# Altium schematic sheet LCD.SchDoc: LCD (part 2 of 2)
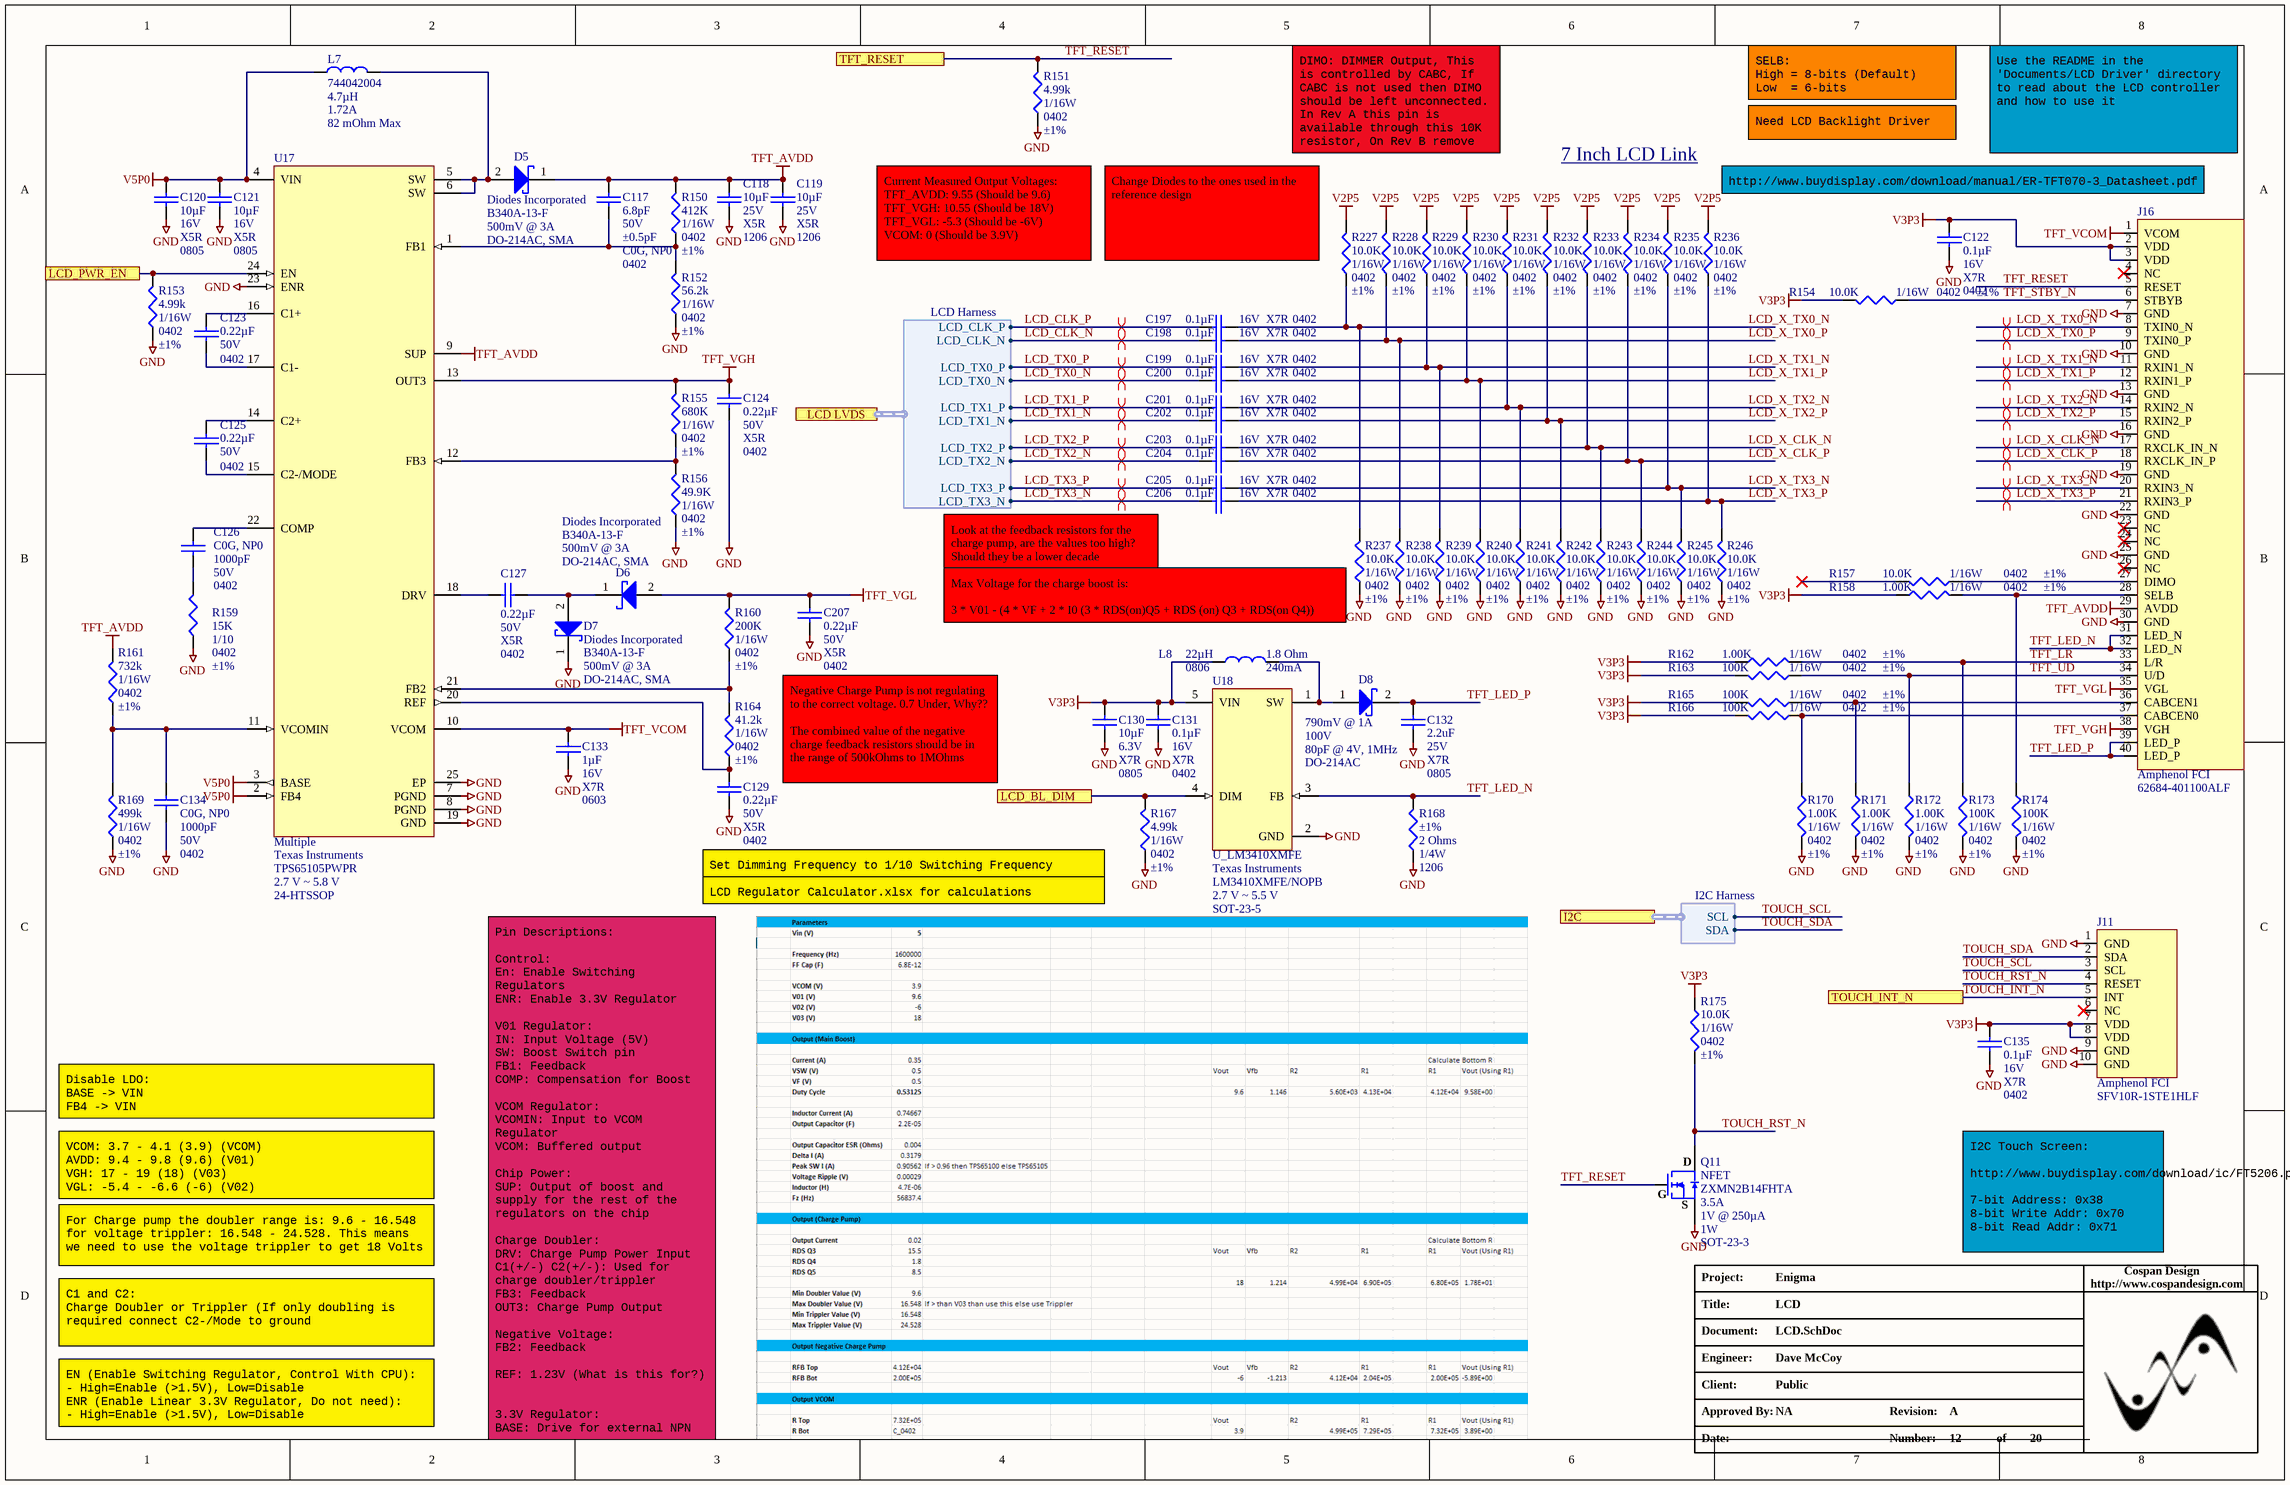
[diagram p1: LCD.SchDoc]

## Library data of the parts
C117 = C_0402_6.8PF_50V: CAP CER 6.8PF 50V NP0 0402; Manufacturer: Yageo; Manufacturer Part Number: CC0402DRNPO9BN6R8; Supplier 1: Digi-Key; Supplier Part Number 1: 311-1637-1-ND; RoHS: RoHS Compliant; Category: Capacitors; Stock 1: 80953; Mounting Type: Surface Mount, MLCC; Operating Temperature: -55°C ~ 125°C; Applications: General Purpose; Ratings: -; Size / Dimension: 0.039" L x 0.020" W (1.00mm x 0.50mm); Height - Seated (Max): -; Thickness (Max): 0.022" (0.55mm); Lead Spacing: -; Features: -; Packaging: Cut Tape (CT); Lead Style: -; ComponentLink1URL: http://www.yageo.com/documents/recent/UPY-GP_NP0_16V-to-50V_16.pdf; ComponentLink1Description: http://www.yageo.com/documents/recent/UPY-GP_NP0_16V-to-50V_16.pdf; Capacitance: 6.8pF; Pricing 1: 1=0.1, 10=0.022, 100=0.0097, 500=0.00692, 1000=0.00544, 2500=0.00494, 5000=0.00455 (USD); Part Status: Active; Failure Rate: -
C118 C119 = C_1206_10UF_25V: CAP CER 10UF 25V X5R 1206; Manufacturer: Murata Electronics North America; Manufacturer Part Number: GRM31CR61E106MA12L; Tolerance: ±20%; Supplier 1: Digi-Key; Supplier Part Number 1: 490-5423-1-ND; RoHS: RoHS Compliant; Category: Capacitors; Stock 1: 359069; Pricing: 1=0.51, 10=0.402, 50=0.2646, 100=0.2099, 250=0.15512, 500=0.12046, 1000=0.0949 (USD); Mounting Type: Surface Mount, MLCC; Operating Temperature: -55°C ~ 85°C; Applications: General Purpose; Ratings: -; Size / Dimension: 0.126" L x 0.063" W (3.20mm x 1.60mm); Height: -; Thickness: 0.071" (1.80mm); Lead Spacing: -; Features: -; Packaging: Cut Tape (CT); Lead Style: -; ComponentLink1URL: http://search.murata.co.jp/Ceramy/image/img/PDF/ENG/GRM31CR61E106MA12.pdf; ComponentLink1Description: http://search.murata.co.jp/Ceramy/image/img/PDF/ENG/GRM31CR61E106MA12.pdf; Capacitance: 10µF
C120 C121 = C_0805_10UF_16V: CAP CER 10uF 16V X5R 20% 0805; Manufacturer: Taiyo Yuden; Manufacturer Part Number: EMK212BJ106KG-T; Tolerance: ±10%; Supplier 1: Digi-Key; Supplier Part Number 1: 587-1295-1-ND; Category: Capacitors; Stock 1: 2052124; Capacitance: 10µF; RoHS: RoHS Compliant; Pricing 1: 1=0.2, 10=0.139, 100=0.0656, 500=0.04596, 1000=0.03805 (USD); Packaging: Cut Tape (CT); Part Status: Active; Operating Temperature: -55°C ~ 85°C; Features: -; Ratings: -; Applications: General Purpose; Mounting Type: Surface Mount, MLCC; Size / Dimension: 0.079" L x 0.049" W (2.00mm x 1.25mm); Height - Seated (Max): -; Thickness (Max): 0.053" (1.35mm); Lead Spacing: -; Lead Style: -; ComponentLink1URL: http://www.yuden.co.jp/productdata/catalog/en/mlcc01_e.pdf; ComponentLink1Description: http://www.yuden.co.jp/productdata/catalog/en/mlcc01_e.pdf
C122 C131 C135 C197-C206 = C_0402_0.1UF_16V: CAP CER .10UF 16V X7R 0402; Manufacturer: Murata Electronics North America; Manufacturer Part Number: GRM155R71C104KA88J; Tolerance: ±10%; Supplier 1: Digi-Key; Supplier Part Number 1: 490-6328-1-ND; RoHS: RoHS Compliant; Category: Capacitors; Stock 1: 18103134; Mounting Type: Surface Mount, MLCC; Features: -; Lead Spacing: -; Packaging: Cut Tape (CT); ComponentLink1URL: http://www.murata.com/~/media/webrenewal/support/library/catalog/products/capacitor/mlcc/c02e.ashx?la=en-us; ComponentLink1Description: http://www.murata.com/~/media/webrenewal/support/library/catalog/products/capacitor/mlcc/c02e.ashx?la=en-us; Operating Temperature: -55°C ~ 125°C; Pricing 1: 1=0.1, 10=0.014, 100=0.0062, 500=0.00442, 1000=0.00348, 2500=0.00316, 5000=0.00291 (USD); Part Status: Active; Ratings: -; Applications: General Purpose; Size / Dimension: 0.039" L x 0.020" W (1.00mm x 0.50mm); Height - Seated (Max): -; Thickness (Max): 0.022" (0.55mm)
C123-C125 C127 C129 C207 = C_0402_0.22UF_50V: CAP CER 0.22UF 50V X5R 0402; Manufacturer: Taiyo Yuden; Manufacturer Part Number: UMK105BJ224KV-F; Tolerance: ±10%; Supplier 1: Digi-Key; RoHS: RoHS Compliant; Category: Capacitors; Stock 1: 141424; Pricing 1: 1=0.35, 10=0.263, 50=0.1532, 100=0.1225, 250=0.08752, 500=0.0595, 1000=0.04813, 5000=0.03763 (USD); Packaging: Digi-Reel®; Mounting Type: Surface Mount, MLCC; Operating Temperature: -55°C ~ 85°C; Applications: General Purpose; Ratings: -; Size / Dimension: 0.039" L x 0.020" W (1.00mm x 0.50mm); Height - Seated (Max): -; Thickness (Max): 0.022" (0.55mm); Lead Spacing: -; Features: -; Lead Style: -; ComponentLink1URL: http://ds.yuden.co.jp/TYCOMPAS/ut/detail.do?productNo=UMK105BJ224KV-F&fileName=UMK105BJ224KV-F_SS&mode=specSheetDownload; ComponentLink1Description: http://ds.yuden.co.jp/TYCOMPAS/ut/detail.do?productNo=UMK105BJ224KV-F&fileName=UMK105BJ224KV-F_SS&mode=specSheetDownload; Supplier Part Number 1: 587-3500-6-ND
  C123 C125: Temperature Coefficient: X5R
C126 C134 = C_0402_1000PF_50V: CAP CER 1000PF 50V C0G 0402; Manufacturer: Murata Electronics North America; Manufacturer Part Number: GRM1555C1H102JA01D; Tolerance: ±5%; Supplier 1: Digi-Key; RoHS: RoHS Compliant; Category: Capacitors; Stock 1: 1327660; Pricing 1: 10=0.073, 100=0.0429, 500=0.02476, 1000=0.01716 (USD); Mounting Type: Surface Mount, MLCC; Operating Temperature: -55°C ~ 125°C; Features: -; Applications: General Purpose; Ratings: -; Size / Dimension: 0.040" L x 0.020" W (1.00mm x 0.50mm); Lead Spacing: -; Thickness: 0.50mm; Packaging: Cut Tape (CT); Lead Style: -; ComponentLink1URL: http://search.murata.co.jp/Ceramy/image/img/PDF/ENG/GRM1555C1H102JA01.pdf; ComponentLink1Description: http://search.murata.co.jp/Ceramy/image/img/PDF/ENG/GRM1555C1H102JA01.pdf; Supplier Part Number 1: 490-3244-1-ND; Capacitance: 1000pF
C130 = C_0805_10UF_6.3V: CAP CER 10UF 6.3V X7R 10% 0805; Manufacturer: Taiyo Yuden; Manufacturer Part Number: JMK212BJ106KD-T; Supplier 1: Digi-Key; Supplier Part Number 1: 587-1304-1-ND; RoHS: RoHS Compliant; Category: Capacitors; Stock 1: 94004; Tolerance: ±10%; Mounting Type: Surface Mount, MLCC; Operating Temperature: -55°C ~ 85°C; Applications: General Purpose; Ratings: -; Size / Dimension: 0.079" L x 0.049" W (2.00mm x 1.25mm); Lead Spacing: -; Features: -; Packaging: Cut Tape (CT); Lead Style: -; ComponentLink1URL: http://www.yuden.co.jp/productdata/catalog/en/mlcc01_e.pdf; ComponentLink1Description: http://www.yuden.co.jp/productdata/catalog/en/mlcc01_e.pdf; Pricing 1: 1=0.19, 10=0.132, 50=0.08, 100=0.0672, 250=0.0544, 500=0.048, 1000=0.0408 (USD); Height - Seated (Max): -; Thickness (Max): 0.037" (0.95mm)
C132 = C_0805_2.2uF_25V: Manufacturer: Taiyo Yuden; Manufacturer Part Number: TMK212B7225KG-TR; Tolerance: ±10%; Supplier 1: Digi-Key; RoHS: RoHS Compliant; Category: Capacitors; Stock 1: 119541; Pricing 1: 1=0.34, 10=0.255, 50=0.1488, 100=0.119, 250=0.085, 500=0.0578, 1000=0.04675 (USD); Packaging: Cut Tape (CT); Part Status: Active; Operating Temperature: -55°C ~ 125°C; Features: -; Ratings: -; Applications: General Purpose; Failure Rate: *; Mounting Type: Surface Mount, MLCC; Size / Dimension: 0.079" L x 0.049" W (2.00mm x 1.25mm); Height - Seated (Max): -; Thickness (Max): 0.053" (1.35mm); Lead Spacing: -; Lead Style: -; ComponentLink1URL: http://ds.yuden.co.jp/TYCOMPAS/ut/detail.do?productNo=TMK212B7225KG-TR&fileName=TMK212B7225KG-TR_SS&mode=specSheetDownload; ComponentLink1Description: http://ds.yuden.co.jp/TYCOMPAS/ut/detail.do?productNo=TMK212B7225KG-TR&fileName=TMK212B7225KG-TR_SS&mode=specSheetDownload; Supplier Part Number 1: 587-2991-1-ND
C133 = C_0603_1µF_16V: CAP CER 1UF 16V X7R 0603; Manufacturer: Yageo; Manufacturer Part Number: CC0603KRX7R7BB105; Tolerance: 10%; Dissipation Factor: 5%; Supplier 1: Digikey; Stock 1: 531531; Pricing 1: 1=0.1, 10=0.053, 100=0.0237, 500=0.0169, 1000=0.0133 (USD); Mount: Surface Mount; Case/Package: 0603; Number of Pins: 2; Case Code (Metric): 1608; Case Code (Imperial): 0603; Min Operating Temperature: -55°C; Max Operating Temperature: 125°C; Voltage Rating: 16V; Package Quantity: 1; Packaging: Tape and Reel; Voltage Rating (DC): 16V; Dielectric: X7R; Termination: SMD/SMT; Composition: Ceramic; Length: 1.6mm; Height: 0.8mm; Width: 0.031inch; Thickness: 0.035inch; Depth: 0.8mm; Radiation Hardening: No; REACH SVHC: Unknown; Lead Free: Lead Free; Halogen Free: Halogen Free; ComponentLink1URL: https://datasheet.ciiva.com/176/mlccorderingcode-176788.pdf; ComponentLink1Description: https://datasheet.ciiva.com/176/mlccorderingcode-176788.pdf; ComponentLink2URL: https://datasheet.ciiva.com/176/mlccorderingcode-176789.pdf; ComponentLink2Description: https://datasheet.ciiva.com/176/mlccorderingcode-176789.pdf; ComponentLink3URL: https://datasheet.ciiva.com/176/mlccorderingcode-176790.pdf; ComponentLink3Description: https://datasheet.ciiva.com/176/mlccorderingcode-176790.pdf; ComponentLink4URL: https://datasheet.ciiva.com/5425/upy-gphc-x7r-6-3v-to-50v-8-12304-5425495.pdf; ComponentLink4Description: https://datasheet.ciiva.com/5425/upy-gphc-x7r-6-3v-to-50v-8-12304-5425495.pdf; ComponentLink5URL: https://datasheet.ciiva.com/16625/upy-gphc-x7r-6-3v-to-50v-8-16625527.pdf; ComponentLink5Description: https://datasheet.ciiva.com/16625/upy-gphc-x7r-6-3v-to-50v-8-16625527.pdf; ComponentLink6URL: https://datasheet.ciiva.com/8033/1734573-8033800.pdf; ComponentLink6Description: https://datasheet.ciiva.com/8033/1734573-8033800.pdf; ComponentLink7URL: https://datasheet.ciiva.com/8033/1734573-8033801.pdf; ComponentLink7Description: https://datasheet.ciiva.com/8033/1734573-8033801.pdf; ComponentLink8URL: https://datasheet.ciiva.com/28450/1489800-28450557.pdf; ComponentLink8Description: https://datasheet.ciiva.com/28450/1489800-28450557.pdf; ComponentLink9URL: https://datasheet.ciiva.com/7978/1489800-7978143.pdf; ComponentLink9Description: https://datasheet.ciiva.com/7978/1489800-7978143.pdf; Supplier Part Number 1: 311-1446-6-ND
D5-D7 = D_B340A-13-F: DIODE SCHOTTKY 40V 3A SMA; Speed: Fast Recovery =< 500ns, > 200mA (Io); Current - Reverse Leakage @ Vr: 500µA @ 40V; Capacitance @ Vr, F: 200pF @ 4V, 1MHz; Supplier 1: Digi-Key; RoHS: RoHS Compliant; Category: Discrete Semiconductor Products; Stock 1: 808310; Pricing 1: 1=0.46, 10=0.373, 100=0.2538, 500=0.19034, 1000=0.14276 (USD); Packaging: Cut Tape (CT); Diode Type: Schottky; Current - Average Rectified (Io): 3A; Mounting Type: Surface Mount; Supplier Device Package: SMA; Operating Temperature - Junction: -55°C ~ 150°C; ComponentLink1URL: https://www.diodes.com/assets/Datasheets/ds30891.pdf; ComponentLink1Description: https://www.diodes.com/assets/Datasheets/ds30891.pdf; Supplier Part Number 1: B340A-FDICT-ND; Part Status: Active
D8 = D_SCHOTT_B1100-13-F: DIODE SCHOTTKY 100V 1A SMA; Manufacturer: Diodes Inc; Speed: Fast Recovery =< 500ns, > 200mA (Io); Current - Reverse Leakage @ Vr: 500µA @ 100V; Supplier 1: Digi-Key; Supplier Part Number 1: B1100-FDICT-ND; Manufacturer Part Number: B1100-13-F; RoHS: RoHS Compliant; Category: Discrete Semiconductor Products; Stock 1: 109264; Pricing: 1=0.57, 10=0.4, 25=0.3288, 100=0.2627, 250=0.1914, 500=0.15544, 1000=0.11948, 2500=0.1073 (USD); Diode Type: Schottky; Current - Average Rectified (Io): 1A; Reverse Recovery Time (trr): -; Mounting Type: Surface Mount; Supplier Device Package: SMA; Packaging: Cut Tape (CT); ComponentLink1URL: http://www.diodes.com/datasheets/ds30018.pdf; ComponentLink1Description: http://www.diodes.com/datasheets/ds30018.pdf; COST_1: *; COST_100: *; COST_1000: *; MANF1: *; MANF1_PN: *; MANF2: *; MANF2_PN: *; MANF3: *; MANF3_PN: *; VENDOR1: *; VENDOR1_PN: *
J11 = J_FFC_CONN_RA_10PIN: CONN FFC BOTTOM 10POS 0.50MM R/A; Flat Flex Type: FFC, FPC; Connector/Contact Type: Contacts, Bottom; Number of Positions: 10; Pitch: 0.020" (0.50mm); FFC, FCB Thickness: 0.30mm, 0.33mm; Locking Feature: Slide Lock; Cable End Type: Straight, Tapered; Actuator Material: Polyphenylene Sulfide (PPS), Glass Filled, Halogen Free; Voltage Rating: 50V; Material Flammability Rating: UL94 V-0; Current Rating: 0.5A; Actuator Color: Black; Mating Cycles: 20; Supplier 1: Digi-Key; RoHS: RoHS Compliant; Category: Connectors, Interconnects; Stock 1: 9118; Pricing 1: 1=0.76, 10=0.667, 25=0.6276, 50=0.6014, 100=0.5752, 250=0.52296, 500=0.47064, 1000=0.41835 (USD); Packaging: Cut Tape (CT); Part Status: Active; Mounting Type: Surface Mount, Right Angle; Termination: Solder; Height Above Board: 0.071" (1.80mm); Contact Material: Phosphor Bronze; Contact Finish: Tin; Housing Material: Polyamide (PA), Nylon, Glass Filled, Halogen Free; Features: Solder Retention, Zero Insertion Force (ZIF); Operating Temperature: -55°C ~ 105°C; Contact Finish Thickness: -; Housing Color: Black; ComponentLink1URL: http://portal.fciconnect.com/Comergent//fci/drawing/10112793.pdf; ComponentLink1Description: http://portal.fciconnect.com/Comergent//fci/drawing/10112793.pdf; Supplier Part Number 1: 609-4305-1-ND
J16 = J_FFC_CONN_RA_40PIN: CONN FPC BOTTOM 40POS 0.50MM R/A; Actuator Material: Glass,Thermoplastic; Gender: Receptacle; Current Rating: 500mA; Voltage Rating: 50V; Contact Resistance: 30mR; Number of Positions: 40; Insulation Resistance: 100MR; Pitch: 0.5mm; Supplier 1: Avnet; Stock 1: 1397; Pricing 1: 1=0.735, 40=0.6936, 100=0.6627, 200=0.6125, 500=0.5422 (USD); Mount: Surface Mount; Case/Package: SMD/SMT; Contact Material: Bronze; Contact Plating: Gold; Housing Colour: Beige; Housing Material: Thermoplastic; Min Operating Temperature: -55°C; Max Operating Temperature: 85°C; Number of Rows: 1; Packaging: Tape and Reel; Package Quantity: 2000; Termination: Solder; Contact Location: Bottom; Number of Contacts: 40; Max Voltage Rating (AC): 50V; Max Voltage Rating (DC): 50V; Orientation: Right Angle; Length: 25.5mm; Depth: 5mm; Width: 5mm; REACH SVHC: No SVHC; Lead Free: Lead Free; Flammability Rating: UL94 V-0; ComponentLink1URL: https://datasheet.ciiva.com/25631/0900766b8118e51f-25631168.pdf; ComponentLink1Description: https://datasheet.ciiva.com/25631/0900766b8118e51f-25631168.pdf; ComponentLink2URL: https://datasheet.ciiva.com/3112/62684-3112007.pdf; ComponentLink2Description: https://datasheet.ciiva.com/3112/62684-3112007.pdf; ComponentLink3URL: https://datasheet.ciiva.com/670/62684-670200.pdf; ComponentLink3Description: https://datasheet.ciiva.com/670/62684-670200.pdf; ComponentLink4URL: https://datasheet.ciiva.com/670/62684-670201.pdf; ComponentLink4Description: https://datasheet.ciiva.com/670/62684-670201.pdf; ComponentLink5URL: https://datasheet.ciiva.com/670/62684-670202.pdf; ComponentLink5Description: https://datasheet.ciiva.com/670/62684-670202.pdf; ComponentLink6URL: https://datasheet.ciiva.com/16659/62684-16659882.pdf; ComponentLink6Description: https://datasheet.ciiva.com/16659/62684-16659882.pdf; ComponentLink7URL: https://datasheet.ciiva.com/16709/70236840-16709916.pdf; ComponentLink7Description: https://datasheet.ciiva.com/16709/70236840-16709916.pdf; ComponentLink8URL: https://datasheet.ciiva.com/3112/62684-3112397.pdf; ComponentLink8Description: https://datasheet.ciiva.com/3112/62684-3112397.pdf; ComponentLink9URL: https://datasheet.ciiva.com/5772/62684-5772782.pdf; ComponentLink9Description: https://datasheet.ciiva.com/5772/62684-5772782.pdf; Supplier Part Number 1: 62684-401100ALF/BKN
L7 = L_4.70UH_1.72A_SMD: INDUCTOR POWER 4.7UH 1.72A SMD; Manufacturer: Wurth Electronics Inc; Current - Saturation: 1.65A; Tolerance: ±30%; Shielding: Shielded; Frequency - Self Resonant: 70MHz; Frequency - Test: 100kHz; Supplier 1: Digi-Key; Supplier Part Number 1: 732-1021-1-ND; RoHS: RoHS Compliant; Category: Inductors, Coils, Chokes; Stock 1: 9223; Pricing: 1=1.85, 25=1.5444, 100=1.3128, 250=1.15836 (USD); Current - Temperature Rise: -; Type: -; Q @ Freq: -; Package / Case: 0.189" L x 0.189" W x 0.071" H (4.80mm x 4.80mm x 1.80mm); Packaging: Cut Tape (CT); Operating Temperature: -40°C ~ 125°C; Material - Core: -; Applications: General Purpose; ComponentLink1URL: http://katalog.we-online.de/kataloge/eisos/media/pdf/744042004.pdf; ComponentLink1Description: http://katalog.we-online.de/kataloge/eisos/media/pdf/744042004.pdf; Mounting Type: Surface Mount
L8 = L_0806_22uH: INDUCTOR 22UH 10% 0806 SMD; Manufacturer: Taiyo Yuden; Type: Wirewound; Current - Saturation: 250mA; Shielding: Unshielded; Frequency - Self Resonant: 16MHz; Frequency - Test: 2.52MHz; Supplier 1: Digi-Key; Supplier Part Number 1: 587-3048-1-ND; Manufacturer Part Number: CBC2016T220K; RoHS: RoHS Compliant; Category: Inductors, Coils, Chokes; Stock 1: 3275; Pricing: 1=0.2, 10=0.192, 50=0.18, 100=0.168, 500=0.132, 1000=0.108 (USD); Packaging: Cut Tape (CT); Material - Core: -; Tolerance: ±10%; Current Rating: 240mA; Q @ Freq: -; Operating Temperature: -40°C ~ 105°C; Mounting Type: Surface Mount; Size / Dimension: 0.079" L x 0.063"W (2.00mm x 1.60mm); Height - Seated (Max): 0.071" (1.80mm); Supplier Device Package: 0806 (2016 Metric); ComponentLink1URL: http://www.yuden.co.jp/ut/product/category/inductor/CBC2016T220K.pdf; ComponentLink1Description: http://www.yuden.co.jp/ut/product/category/inductor/CBC2016T220K.pdf
Q11 = Q_NFET_3.50A_SOT23: MOSFET N-CH 20V 3.5A SOT23-3; Manufacturer: Diodes Incorporated; FET Type: N-Channel; Current - Continuous Drain (Id) @ 25°C: 3.5A (Ta); Drive Voltage (Max Rds On,  Min Rds On): 1.8V, 4.5V; Gate Charge (Qg) (Max) @ Vgs: 11nC @ 4.5V; Input Capacitance (Ciss) (Max) @ Vds: 872pF @ 10V; Vgs (Max): ±8V; Power Dissipation (Max): 1W (Ta); Rds On (Max) @ Id, Vgs: 55 mOhm @ 3.5A, 4.5V; Supplier 1: Digi-Key; RoHS: RoHS Compliant; Category: Discrete Semiconductor Products; Stock 1: 1379; Pricing 1: 1=0.78, 10=0.683, 100=0.5238, 500=0.41406, 1000=0.33125 (USD); Packaging: Cut Tape (CT); Part Status: Active; Technology: MOSFET (Metal Oxide); Drain to Source Voltage (Vdss): 20V; FET Feature: -; Operating Temperature: -55°C ~ 150°C (TJ); Mounting Type: Surface Mount; Supplier Device Package: SOT-23-3; ComponentLink1URL: http://www.diodes.com/_files/datasheets/ZXMN2B14FH.pdf; ComponentLink1Description: http://www.diodes.com/_files/datasheets/ZXMN2B14FH.pdf; Supplier Part Number 1: ZXMN2B14FHCT-ND
R150 = R_0402_412K: Manufacturer 1: Yageo; Manufacturer Part Number 1: RC0402FR-07412KL; Description 1: Thick Film Resistors 412K OHM 1%; Voltage Rating: 50V; Resistance: 412kR; Power Rating: 62.5mW; Temperature Coefficient: 100ppm/°C; Max Power Dissipation: 63mW; Supplier 1: Mouser; Supplier Part Number 1: 603-RC0402FR-07412KL; Stock 1: 8330; Pricing 1: 1=0.1, 10=0.008, 50=0.008, 100=0.002, 1000=0.002, 10000=0.002 (USD); Case/Package: 0402; Weight: 2.3E-05oz; Case Code (Imperial): 0402; Case Code (Metric): 1005; Contact Plating: Tin,Matte; Min Operating Temperature: -55°C; Max Operating Temperature: 155°C; Packaging: Tape and Reel; Composition: Thick Film; Termination: SMD/SMT; Number of Terminations: 2; Military Standard: Not; Voltage Rating (DC): 50V; Length: 1mm; Height: 0.016inch; Width: 0.5mm; Depth: 0.5mm; Lead Free: Lead Free; ComponentLink1URL: https://datasheet.ciiva.com/28390/pyu-rc0402-51-rohs-l-6-28390954.pdf; ComponentLink1Description: https://datasheet.ciiva.com/28390/pyu-rc0402-51-rohs-l-6-28390954.pdf; ComponentLink2URL: https://datasheet.ciiva.com/16857/pyu-rc0402-51-rohs-l-6-16857086.pdf; ComponentLink2Description: https://datasheet.ciiva.com/16857/pyu-rc0402-51-rohs-l-6-16857086.pdf
R151 R153 R167 = R_0402_4.99k: RES TF 4.99K OHM 1% 1/16W 0402; Manufacturer: Stackpole Electronics Inc; Manufacturer Part Number: RMCF0402FT4K99; Temperature Coefficient: ±100ppm/°C; Supplier 1: Digi-Key; RoHS: RoHS Compliant; Category: Resistors; Stock 1: 81236; Pricing 1: 1=0.04, 10=0.025, 50=0.0138, 100=0.0105, 250=0.0078, 500=0.00576, 1000=0.00384, 2500=0.00324, 5000=0.0027 (USD); Resistance (Ohms): 4.99k; Composition: Thick Film; Features: -; Package / Case: 0402 (1005 Metric); Size / Dimension: 0.039" L x 0.020" W (1.00mm x 0.50mm); Height: 0.016" (0.40mm); Number of Terminations: 2; Packaging: Cut Tape (CT); ComponentLink1URL: http://www.seielect.com/Catalog/SEI-RMCF_RMCP.pdf; ComponentLink1Description: http://www.seielect.com/Catalog/SEI-RMCF_RMCP.pdf; Supplier Part Number 1: RMCF0402FT4K99CT-ND; Resistance In Ohms: 4.99k
R152 = R_0402_56.2k: RES 56.2K OHM 1/16W 1% 0402 SMD; Manufacturer: Vishay Dale; Manufacturer Part Number: CRCW040256K2FKED; Temperature Coefficient: ±100ppm/°C; Supplier 1: Digi-Key; Supplier Part Number 1: 541-56.2KLCT-ND; RoHS: RoHS Compliant; Category: Resistors; Stock 1: 2237; Pricing: 10=0.083, 50=0.0444, 200=0.0255, 1000=0.0174 (USD); Resistance (Ohms): 56.2k; Composition: Thick Film; Features: -; Package / Case: 0402 (1005 Metric); Size / Dimension: 0.039" L x 0.020" W (1.00mm x 0.50mm); Height: 0.016" (0.40mm); Number of Terminations: 2; Packaging: Cut Tape (CT); ComponentLink1URL: http://www.vishay.com/doc?20035; ComponentLink1Description: http://www.vishay.com/doc?20035; Resistance In Ohms: 56.2k
R154 R157 R175 R227-R246 = R_0402_10.0K: RES 10.0K OHM 1/16W 1% 0402 SMD; Manufacturer: Stackpole Electronics Inc; Manufacturer Part Number: RMCF0402FT10K0; Resistance (Ohms): 10k; Temperature Coefficient: ±100ppm/°C; Supplier 1: Digi-Key; Supplier Part Number 1: RMCF0402FT10K0CT-ND; RoHS: RoHS Compliant; Category: Resistors; Stock 1: 234525; Pricing: 1=0.04, 10=0.025, 50=0.0138, 100=0.0105, 250=0.0078, 500=0.00576, 1000=0.00384, 2500=0.00324, 5000=0.0027 (USD); Composition: Thick Film; Features: -; Package / Case: 0402 (1005 Metric); Size / Dimension: 0.039" L x 0.020" W (1.00mm x 0.50mm); Height: 0.016" (0.40mm); Number of Terminations: 2; Packaging: Cut Tape (CT); ComponentLink1URL: http://www.seielect.com/Catalog/SEI-RMCF_RMCP.pdf; ComponentLink1Description: http://www.seielect.com/Catalog/SEI-RMCF_RMCP.pdf
R155 = R_0402_680K: Res Thick Film 0402 68K Ohm 1% 0.1W(1/10W) Â±100ppm/Â°C Molded SMD Automotive Punched T/R; Manufacturer: Yageo; Manufacturer Part Number: RC0402FR-07680KL; Temperature Coefficient: ±100ppm/°C; Supplier 1: Digi-Key; Stock 1: 179358; Pricing 1: 1=0.1, 10=0.014, 100=0.0055, 1000=0.00247, 2500=0.00214, 5000=0.00177 (USD); ComponentLink1URL: http://www.yageo.com/documents/recent/PYu-RC_Group_51_RoHS_L_7.pdf; ComponentLink1Description: http://www.yageo.com/documents/recent/PYu-RC_Group_51_RoHS_L_7.pdf; Supplier Part Number 1: YAG3211CT-ND; RoHS: RoHS Compliant; Category: Resistors; Packaging: Cut Tape (CT); Part Status: Active; Composition: Thick Film; Features: Moisture Resistant; Operating Temperature: -55°C ~ 155°C; Package / Case: 0402 (1005 Metric); Supplier Device Package: 0402; Size / Dimension: 0.039" L x 0.020" W (1.00mm x 0.50mm); Height - Seated (Max): 0.016" (0.40mm); Failure Rate: -
R156 = R_0402_49.9K: RES 49.9K OHM 1/16W 1% 0402 SMD; Manufacturer: Vishay Dale; Manufacturer Part Number: CRCW040249K9FKED; Temperature Coefficient: ±100ppm/°C; Supplier 1: Digi-Key; Supplier Part Number 1: 541-49.9KLCT-ND; RoHS: RoHS Compliant; Category: Resistors; Stock 1: 96786; Pricing: 10=0.083, 50=0.0444, 200=0.0255, 1000=0.0174 (USD); Resistance (Ohms): 49.9K; Composition: Thick Film; Features: -; Package / Case: 0402 (1005 Metric); Size / Dimension: 0.039" L x 0.020" W (1.00mm x 0.50mm); Height: 0.016" (0.40mm); Number of Terminations: 2; Packaging: Cut Tape (CT); ComponentLink1URL: http://www.vishay.com/doc?20035; ComponentLink1Description: http://www.vishay.com/doc?20035; Supplier 2: Digi-Key; Stock 2: 838340; Pricing 2: 1=0.1, 10=0.014, 100=0.0056, 1000=0.00253, 2500=0.0022, 5000=0.00181 (USD); Part Status: Active; Operating Temperature: -55°C ~ 155°C; Supplier Device Package: 0402; Height - Seated (Max): 0.016" (0.40mm); Failure Rate: -; ComponentLink2URL: http://www.yageo.com/documents/recent/PYu-RC_Group_51_RoHS_L_7.pdf; ComponentLink2Description: http://www.yageo.com/documents/recent/PYu-RC_Group_51_RoHS_L_7.pdf; Supplier Part Number 2: 311-49.9KLRCT-ND
R158 R162 R170-R172 = R_0402_1.0K: RES 1.00K OHM 1/16W 1% 0402 SMD; Manufacturer: Yageo; Manufacturer Part Number: RC0402FR-071KL; Resistance (Ohms): 1K; Temperature Coefficient: ±100ppm/°C; Supplier 1: Digi-Key; Supplier Part Number 1: 311-1.00KLRCT-ND; RoHS: RoHS Compliant; Category: Resistors; Stock 1: 2103351; Pricing: 10=0.014, 100=0.0063, 500=0.00382, 1000=0.0027, 5000=0.00203 (USD); Composition: Thick Film; Features: -; Package / Case: 0402 (1005 Metric); Size / Dimension: 0.039" L x 0.020" W (1.00mm x 0.50mm); Height: 0.016" (0.40mm); Number of Terminations: 2; Packaging: Cut Tape (CT); ComponentLink1URL: http://www.yageo.com/documents/recent/PYu-RC0402_51_RoHS_L_6.pdf; ComponentLink1Description: http://www.yageo.com/documents/recent/PYu-RC0402_51_RoHS_L_6.pdf
R159 = R_0402_15.0K: RES 15.0K OHM 1/10W 1% 0402 SMD; Manufacturer: Panasonic - ECG; Manufacturer Part Number: ERJ-2RKF1502X; Temperature Coefficient: ±100ppm/°C; Supplier 1: Digi-Key; Supplier Part Number 1: P15.0KLCT-ND; RoHS: RoHS Compliant; Category: Resistors; Stock 1: 695227; Pricing: 1=0.06, 50=0.0242, 100=0.0184, 250=0.01364, 500=0.01008, 1000=0.00672, 5000=0.00473 (USD); Resistance (Ohms): 15K; Composition: Thick Film; Features: -; Size / Dimension: 0.039" L x 0.020" W (1.00mm x 0.50mm); Height: 0.016" (0.40mm); Number of Terminations: 2; Packaging: Cut Tape (CT); Package / Case: 0402 (1005 Metric); ComponentLink1URL: http://industrial.panasonic.com/www-cgi/jvcr13pz.cgi?E+PZ+3+AOA0002+ERJ2RKF1502X+7+WW; ComponentLink1Description: http://industrial.panasonic.com/www-cgi/jvcr13pz.cgi?E+PZ+3+AOA0002+ERJ2RKF1502X+7+WW
R160 = R_0402_200.0K: RES 200K OHM 1/16W 1% 0402 SMD; Manufacturer: Yageo; Manufacturer Part Number: RC0402FR-07200KL; Temperature Coefficient: ±100ppm/°C; Supplier 1: Digi-Key; Supplier Part Number 1: 311-200KLRCT-ND; RoHS: RoHS Compliant; Category: Resistors; Stock 1: 533277; Pricing: 10=0.014, 50=0.0104, 100=0.0079, 250=0.00584, 500=0.00432, 1000=0.00288 (USD); Resistance (Ohms): 200K; Composition: Thick Film; Features: -; Size / Dimension: 0.039" L x 0.020" W (1.00mm x 0.50mm); Height: 0.016" (0.40mm); Number of Terminations: 2; Packaging: Cut Tape (CT); Package / Case: 0402 (1005 Metric); ComponentLink1URL: http://www.yageo.com/documents/recent/PYu-RC0402_51_RoHS_L_6.pdf; ComponentLink1Description: http://www.yageo.com/documents/recent/PYu-RC0402_51_RoHS_L_6.pdf
R161 = R_0402_732k: RES SMD 732K OHM 1% 1/16W 0402; Manufacturer: Yageo; Manufacturer Part Number: RC0402FR-07732KL; Temperature Coefficient: ±100ppm/°C; Supplier 1: Digi-Key; RoHS: RoHS Compliant; Category: Resistors; Stock 1: 86604; Pricing 1: 1=0.1, 10=0.014, 100=0.0055, 1000=0.00247, 2500=0.00214, 5000=0.00177 (USD); Packaging: Cut Tape (CT); Part Status: Active; Composition: Thick Film; Features: Moisture Resistant; Operating Temperature: -55°C ~ 155°C; Package / Case: 0402 (1005 Metric); Supplier Device Package: 0402; Size / Dimension: 0.039" L x 0.020" W (1.00mm x 0.50mm); Height - Seated (Max): 0.016" (0.40mm); Failure Rate: -; ComponentLink1URL: http://www.yageo.com/documents/recent/PYu-RC_Group_51_RoHS_L_7.pdf; ComponentLink1Description: http://www.yageo.com/documents/recent/PYu-RC_Group_51_RoHS_L_7.pdf; Supplier Part Number 1: YAG3224CT-ND
R163 R165 R166 R173 R174 = R_0402_100K: RES SMD 100K OHM 1% 1/16W 0402; Manufacturer: Yageo; Manufacturer Part Number: RC0402FR-07100KL; Temperature Coefficient: ±100ppm/°C; Supplier 1: Digi-Key; RoHS: RoHS Compliant; Category: Resistors; Stock 1: 4989982; Pricing 1: 1=0.1, 10=0.013, 25=0.0096, 100=0.0054, 250=0.00412, 500=0.00328, 1000=0.00242, 2500=0.0021, 5000=0.00173 (USD); Packaging: Cut Tape (CT); Resistance (Ohms): 100k; Composition: Thick Film; Features: Moisture Resistant; Operating Temperature: -55°C ~ 155°C; Package / Case: 0402 (1005 Metric); Supplier Device Package: 0402; Size / Dimension: 0.039" L x 0.020" W (1.00mm x 0.50mm); Height: 0.016" (0.40mm); Number of Terminations: 2; ComponentLink1URL: http://www.yageo.com/NewPortal/yageodocoutput?fileName=/pdf/R-Chip/PYu-RC_Group_51_RoHS_L_3.pdf; ComponentLink1Description: http://www.yageo.com/NewPortal/yageodocoutput?fileName=/pdf/R-Chip/PYu-RC_Group_51_RoHS_L_3.pdf; Supplier Part Number 1: 311-100KLRCT-ND
R164 = R_0402_41.2K: RES SMD 41.2K OHM 1% 1/16W 0402; Manufacturer: Yageo; Manufacturer Part Number: RC0402FR-0741K2L; Temperature Coefficient: ±100ppm/°C; Supplier 1: Digi-Key; RoHS: RoHS Compliant; Category: Resistors; Stock 1: 299912; Pricing 1: 1=0.1, 10=0.014, 100=0.0055, 1000=0.00247, 2500=0.00214, 5000=0.00177 (USD); Packaging: Cut Tape (CT); Part Status: Active; Composition: Thick Film; Features: Moisture Resistant; Operating Temperature: -55°C ~ 155°C; Package / Case: 0402 (1005 Metric); Supplier Device Package: 0402; Size / Dimension: 0.039" L x 0.020" W (1.00mm x 0.50mm); Height - Seated (Max): 0.016" (0.40mm); Failure Rate: -; ComponentLink1URL: http://www.yageo.com/documents/recent/PYu-RC_Group_51_RoHS_L_7.pdf; ComponentLink1Description: http://www.yageo.com/documents/recent/PYu-RC_Group_51_RoHS_L_7.pdf; Supplier Part Number 1: YAG3155CT-ND
R168 = R_1206_2: RES SMD 2 OHM 1% 1/4W 1206; Manufacturer: Yageo; Manufacturer Part Number: RC1206FR-072RL; Temperature Coefficient: ±200ppm/°C; Supplier 1: Digi-Key; RoHS: RoHS Compliant; Category: Resistors; Stock 1: 1070212; Pricing 1: 1=0.1, 10=0.053, 100=0.0216, 1000=0.00972, 2500=0.00844 (USD); Packaging: Cut Tape (CT); Part Status: Active; Composition: Thick Film; Features: Moisture Resistant; Operating Temperature: -55°C ~ 155°C; Package / Case: 1206 (3216 Metric); Supplier Device Package: 1206; Size / Dimension: 0.122" L x 0.063" W (3.10mm x 1.60mm); Height - Seated (Max): 0.026" (0.65mm); Failure Rate: -; ComponentLink1URL: http://www.yageo.com/documents/recent/PYu-RC_Group_51_RoHS_L_7.pdf; ComponentLink1Description: http://www.yageo.com/documents/recent/PYu-RC_Group_51_RoHS_L_7.pdf; Supplier Part Number 1: 311-2.00FRCT-ND
R169 = R_0402_499k: RES SMD 499K OHM 1% 1/16W 0402; Manufacturer: Yageo; Manufacturer Part Number: RC0402FR-07499KL; Temperature Coefficient: ±100ppm/°C; Supplier 1: Digi-Key; RoHS: RoHS Compliant; Category: Resistors; Stock 1: 691166; Pricing 1: 1=0.1, 10=0.013, 25=0.0096, 100=0.0054, 250=0.00412, 500=0.00328, 1000=0.00242, 2500=0.0021, 5000=0.00173 (USD); Packaging: Cut Tape (CT); Resistance (Ohms): 499k; Composition: Thick Film; Features: Moisture Resistant; Operating Temperature: -55°C ~ 155°C; Package / Case: 0402 (1005 Metric); Supplier Device Package: 0402; Size / Dimension: 0.039" L x 0.020" W (1.00mm x 0.50mm); Height: 0.016" (0.40mm); Number of Terminations: 2; ComponentLink1URL: http://www.yageo.com/NewPortal/yageodocoutput?fileName=/pdf/R-Chip/PYu-RC_Group_51_RoHS_L_3.pdf; ComponentLink1Description: http://www.yageo.com/NewPortal/yageodocoutput?fileName=/pdf/R-Chip/PYu-RC_Group_51_RoHS_L_3.pdf; Supplier Part Number 1: 311-499KLRCT-ND
U17 = U_TPS65105PWPR: IC LCD SUPPLY TFT QUAD 24HTSSOP; Number of Outputs: 4; Supplier 1: Digi-Key; RoHS: RoHS Compliant; Category: Integrated Circuits (ICs); Stock 1: 2905; Pricing 1: 1=2.84, 10=2.549, 100=2.0888, 500=1.7782, 1000=1.49968 (USD); Packaging: Cut Tape (CT); Part Status: Active; Applications: Controller, TFT LCD; Operating Temperature: -40°C ~ 85°C; Mounting Type: Surface Mount; Package / Case: 24-TSSOP (0.173", 4.40mm Width) Exposed Pad; ComponentLink1URL: http://www.ti.com/lit/ds/symlink/tps65100.pdf; ComponentLink1Description: http://www.ti.com/lit/ds/symlink/tps65100.pdf; Supplier Part Number 1: 296-18992-1-ND
U18 = U_LM3410XMFE: IC DRVR WT/OLED BCKLT SOT23-5; Constant Current: Yes; Topology: PWM, SEPIC, Step-Up (Boost); Number of Outputs: 1; Type - Primary: Automotive, Backlight, Flash/Torch; Type - Secondary: High Brightness LED (HBLED), OLED, White LED; Frequency: 1.2MHz ~ 2MHz; Voltage - Output: 3 V ~ 24 V; Supplier 1: Digi-Key; Supplier Part Number 1: LM3410XMFE/NOPBCT-ND; RoHS: RoHS Compliant; Category: Integrated Circuits (ICs); Stock 1: 405; Pricing: 1=2.98, 10=2.67, 25=2.4012, 100=2.1839 (USD); Packaging: Cut Tape (CT); Constant Voltage: -; Internal Driver: Yes; Mounting Type: Surface Mount; Package / Case: SC-74A, SOT-753; Operating Temperature: -40°C ~ 125°C; ComponentLink1URL: http://www.ti.com/lit/ds/symlink/lm3410.pdf; ComponentLink1Description: http://www.ti.com/lit/ds/symlink/lm3410.pdf